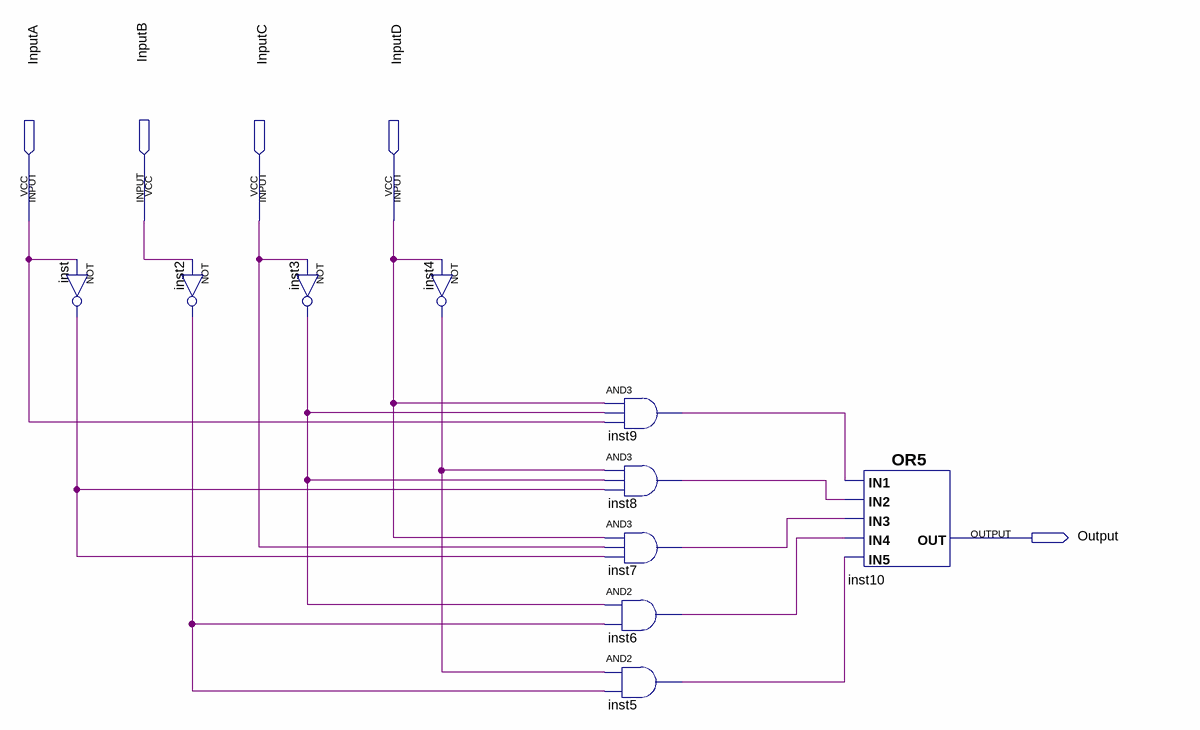
[diagram p0: schematic sheet]
// Quartus schematic SegB.bdf as structural Verilog: 10 symbols, 5 pins
module SegB (
  input  InputA,
  input  InputB,
  input  InputC,
  input  InputD,
  output Output
);

  wire inst2_out, inst3_out, inst4_out, inst5_out, inst6_out, inst7_out, inst8_out, inst9_out, inst_out;

  not inst (inst_out, InputA);
  not inst2 (inst2_out, InputB);
  not inst3 (inst3_out, InputC);
  not inst4 (inst4_out, InputD);
  and inst9 (inst9_out, InputD, inst3_out, InputA);
  and inst8 (inst8_out, inst4_out, inst3_out, inst_out);
  and inst7 (inst7_out, InputD, InputC, inst_out);
  and inst6 (inst6_out, inst3_out, inst2_out);
  and inst5 (inst5_out, inst4_out, inst2_out);
  or inst10 (Output, inst9_out, inst8_out, inst7_out, inst6_out, inst5_out);
endmodule
